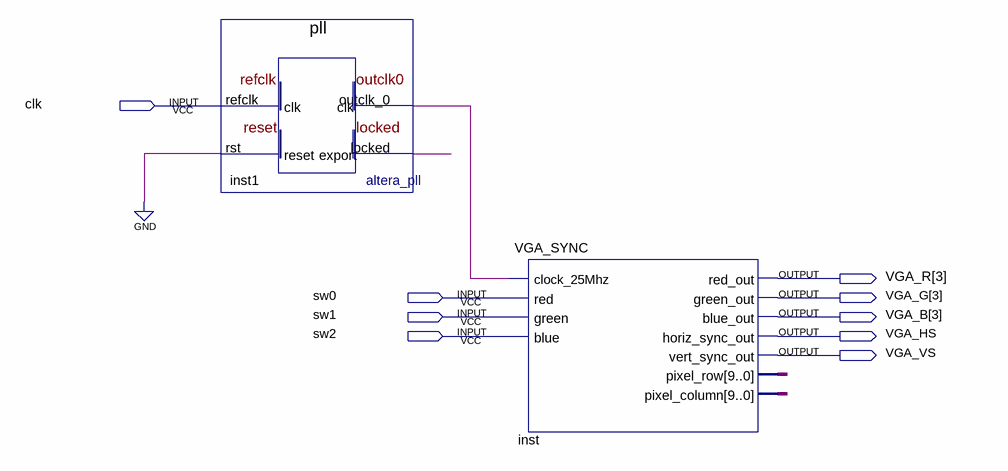
[diagram p0: schematic sheet]
// Quartus schematic VGA_Colour_Switch.bdf as structural Verilog: 2 symbols, 9 pins
module VGA_Colour_Switch (
  input  clk,
  input  sw0,
  input  sw1,
  input  sw2,
  output [3:3] VGA_R,
  output [3:3] VGA_G,
  output [3:3] VGA_B,
  output VGA_HS,
  output VGA_VS
);

  wire inst1_locked, inst1_outclk_0;
  wire [9:0] inst_pixel_column, inst_pixel_row;

  pll inst1 (.refclk(clk), .rst(1'b0), .outclk_0(inst1_outclk_0), .locked(inst1_locked));
  VGA_SYNC inst (
    .clock_25Mhz(inst1_outclk_0), .red(sw0), .green(sw1), .blue(sw2), .red_out(VGA_R[3]),
    .green_out(VGA_G[3]), .blue_out(VGA_B[3]), .horiz_sync_out(VGA_HS), .vert_sync_out(VGA_VS),
    .pixel_row(inst_pixel_row), .pixel_column(inst_pixel_column));
endmodule
